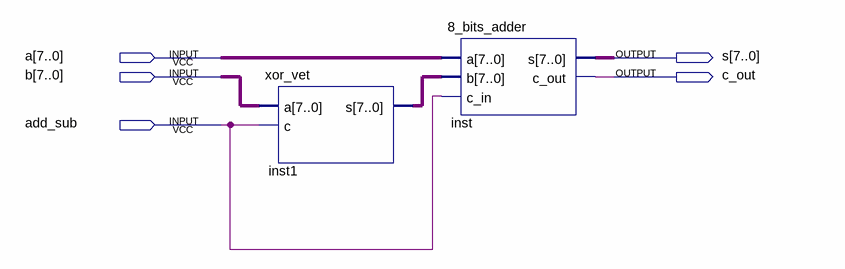
[diagram p0: schematic sheet]
// Quartus schematic digital_circuits_final_work.bdf as structural Verilog: 2 symbols, 5 pins
module digital_circuits_final_work (
  input  [7:0] a,
  input  [7:0] b,
  input  add_sub,
  output [7:0] s,
  output c_out
);

  wire [7:0] inst1_s;

  xor_vet inst1 (.a(b), .c(add_sub), .s(inst1_s));
  \8_bits_adder  inst (.a(a), .b(inst1_s), .c_in(add_sub), .s(s), .c_out(c_out));
endmodule
